# EAGLE design oshpark2.1.3-controller (EAGLE 6.6.0)
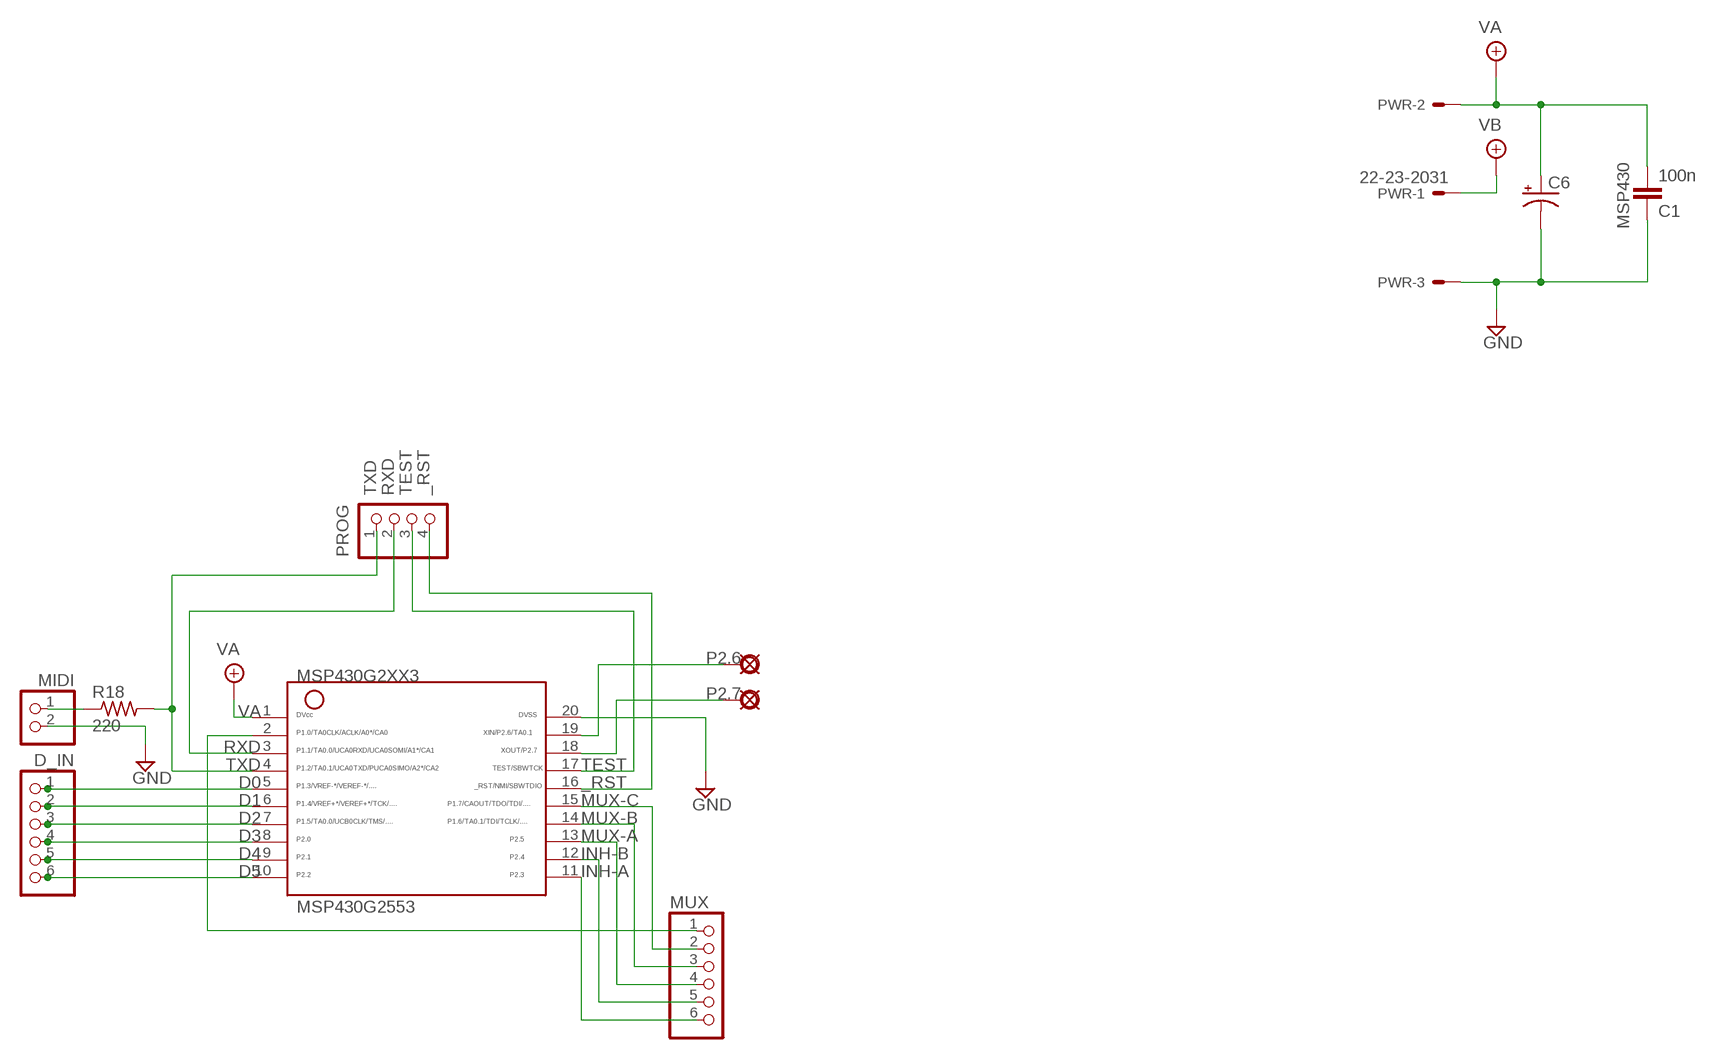
[diagram p0: schematic, sheet 1]

## Parts
C1  100n  050X030_050  [050X030_050_3]
C6  0503  [050_020_3]
D_IN  PINHD-1X6  [1X06]
MIDI  PINHD-1X2  [1X02]
MSP430G2553  G2XX3---N20  [N20]
MUX  PINHD-1X6  [1X06]
P2.6  PAD  [SQUARE]
P2.7  PAD  [SQUARE]
PROG  PINHD-1X4  [1X04]
PWR  22-23-2031  [22-23-2031]
R18  220  6MM.3  [R0207/3]

## Nets
_RST: MSP430G2553.16 PROG.4
D0: D_IN.1 MSP430G2553.5
D1: D_IN.2 MSP430G2553.6
D2: D_IN.3 MSP430G2553.7
D3: D_IN.4 MSP430G2553.8
D4: D_IN.5 MSP430G2553.9
D5: D_IN.6 MSP430G2553.10
GND: C1.1 C6.- MIDI.2 MSP430G2553.20 PWR.3
INH-A: MSP430G2553.11 MUX.6
INH-B: MSP430G2553.12 MUX.5
MUX-A: MSP430G2553.13 MUX.4
MUX-B: MSP430G2553.14 MUX.3
MUX-C: MSP430G2553.15 MUX.2
N$1: MIDI.1 R18.1
N$2: MSP430G2553.2 MUX.1
N$3: MSP430G2553.19 P2.6.1(PAD)
N$4: MSP430G2553.18 P2.7.1(PAD)
RXD: MSP430G2553.3 PROG.2
TEST: MSP430G2553.17 PROG.3
TXD: MSP430G2553.4 PROG.1 R18.2
VA: C1.2 C6.+ MSP430G2553.1 PWR.2
VB: PWR.1

## Notes on the sheet
- MSP430

## Library data of the parts
C1 = gm-caps-ceramic:050X030_050: 120 - 150pF Xicon Ceramic Disc 5mm lead spacing
C6 = gm-caps-electro-pol:050: 0.22 - 100uF Xicon values at Mouser.com: 10V: 10 - 100uF; 16V: 2.2 - 47uF; 25V: 0.47 - 47uF; 50V: 0.22 - 22uF
D_IN MUX = pinhead:PINHD-1X6: PIN HEADER
MIDI = pinhead:PINHD-1X2: PIN HEADER
MSP430G2553 = TI_MSP430_v16:G2XX3---N20: MSP430G2XX1 PDIP (N) 20 Pin Package
P2.6 P2.7 = gm-supply:PAD: PAD use this package for pads with any purpose, including input, output, send or return various pad shapes: round, square, octogonal, long, and long offset
PROG = pinhead:PINHD-1X4: PIN HEADER
PWR = con-molex:22-23-2031: .100" (2.54mm) Center Header - 3 Pin; MF: MOLEX; MPN: 22-23-2031; OC_FARNELL: 1462950; OC_NEWARK: 30C0862
R18 = gm-resistors:6MM: 6mm Resistors Leads spaced 1-6 holes apart for 0.1" perfboard. Suitable for 1/4 watt resistors.

## Board
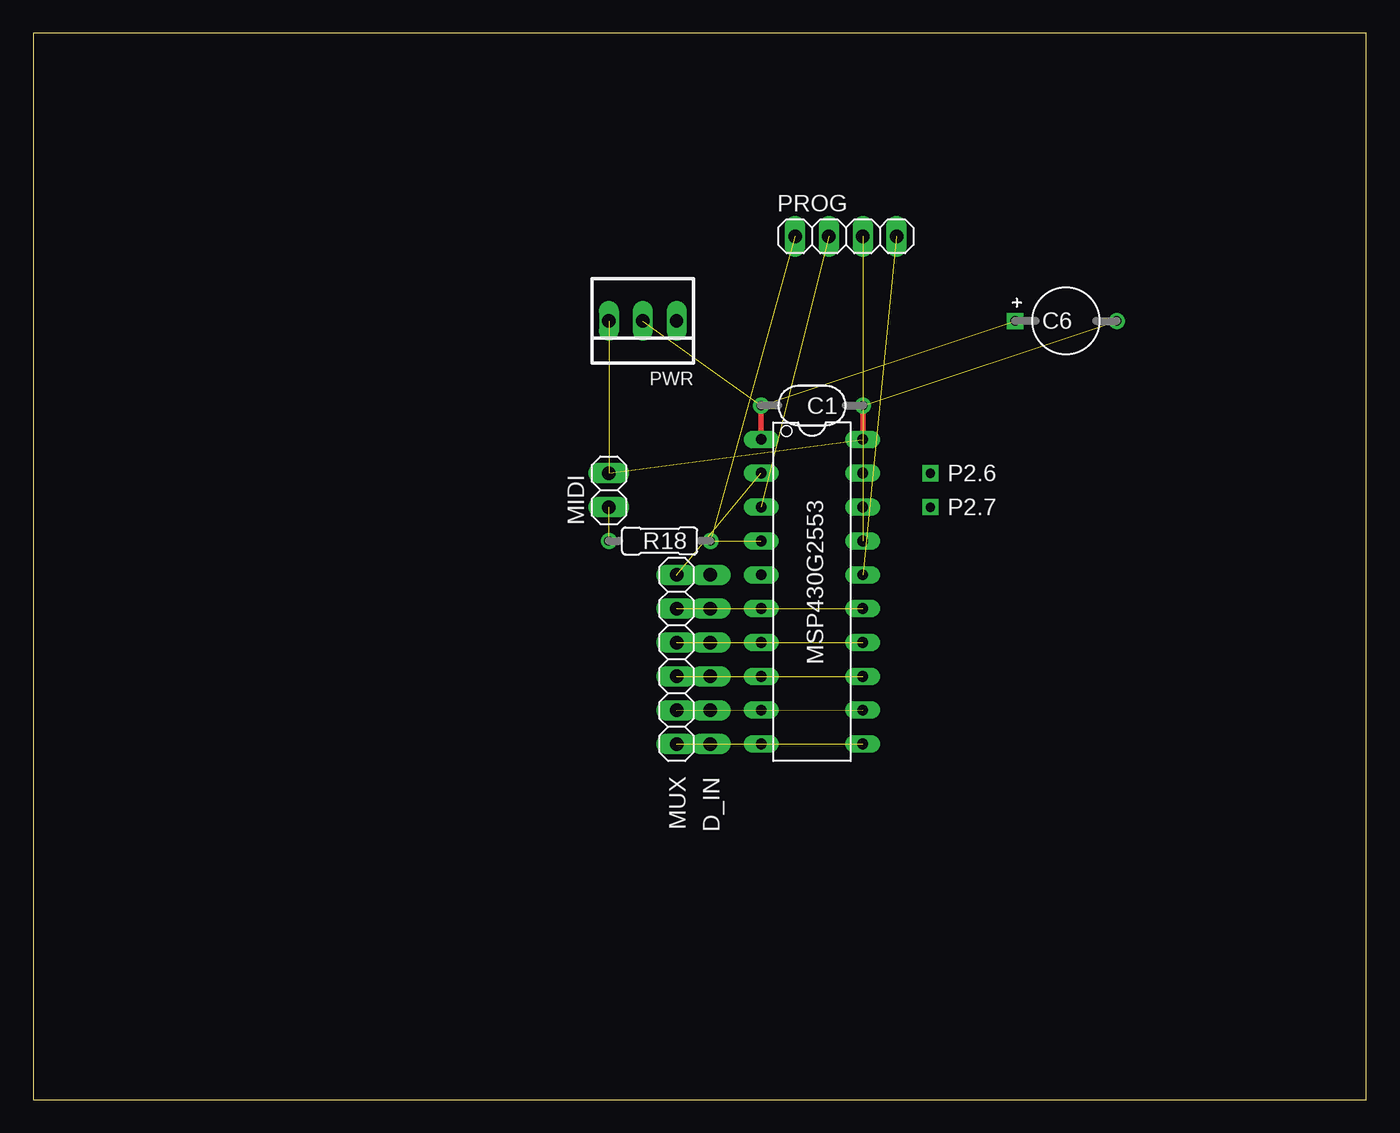
[diagram p1: board, top side]
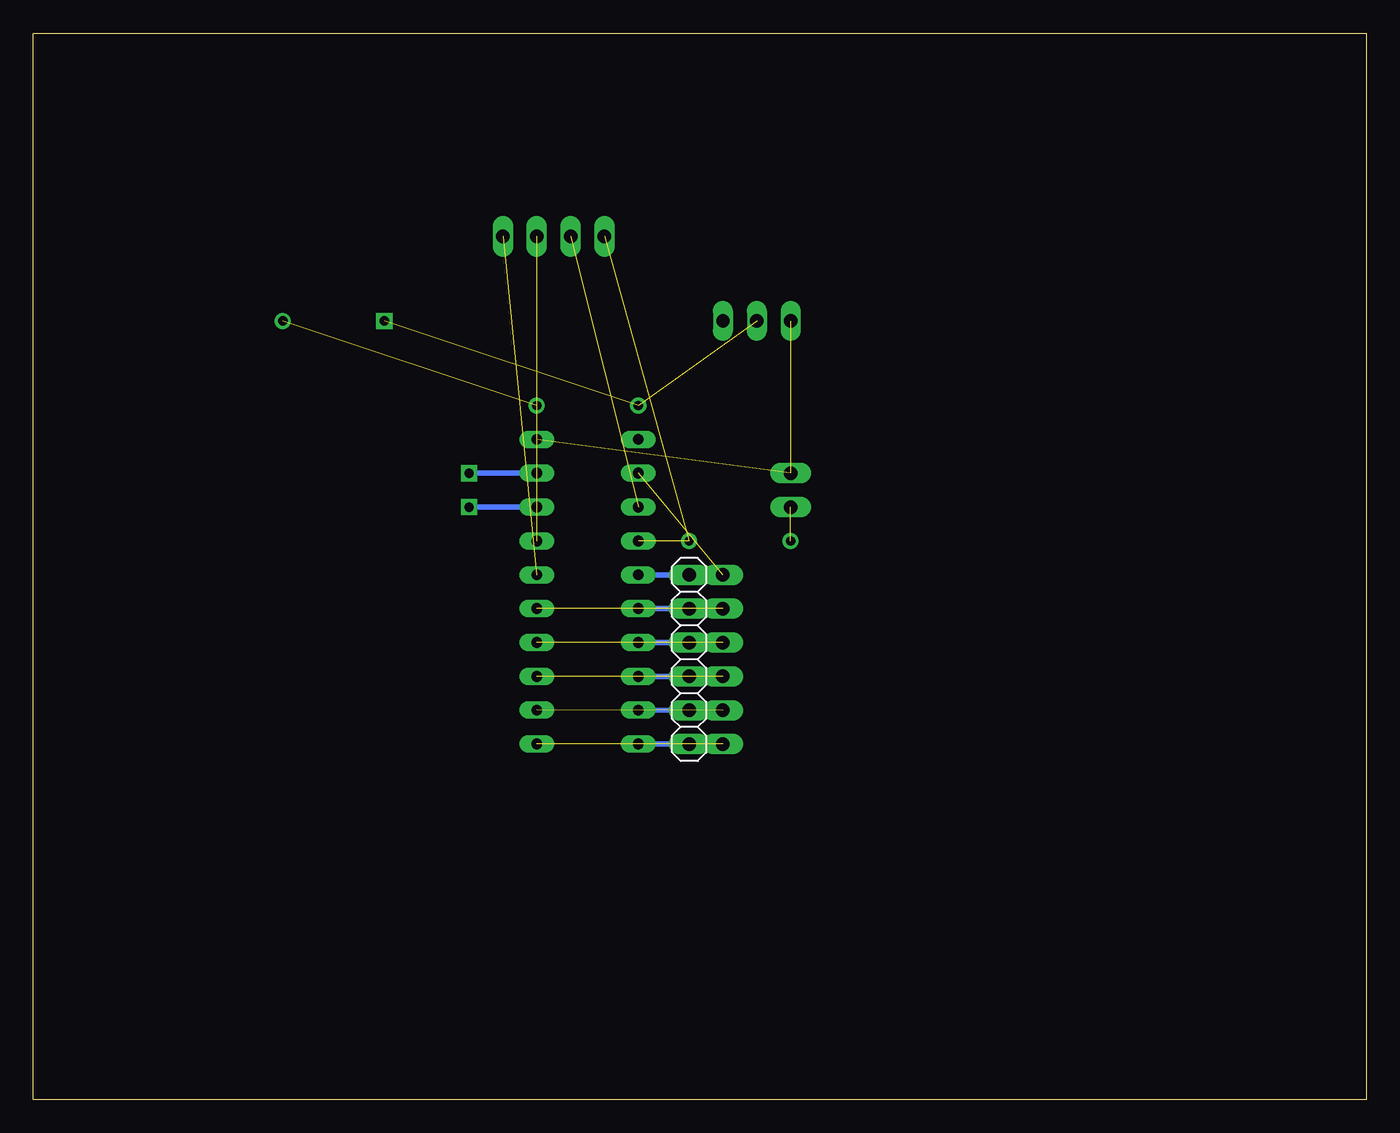
[diagram p2: board, bottom side, seen from below]

Size 100 x 80 mm. Coordinates in mm from the lower left corner, seen from the top.
Outline: 0,0 100,0 100,80 0,80 0,0
Copper layers (1*16): Top 0.035mm / dielectric 1.5mm / Bottom 0.035mm
Design rules "default": minimum track width 10mil, minimum drill 24mil, track to track 8mil, track to pad 8mil, pad to pad 8mil, via to via 8mil, smd to smd 8mil, copper to edge 40mil, drill to drill 8mil, minimum pad ring 10mil, minimum via ring 8mil, stop-mask expansion 4mil, vias tented up to drill 0mil, thermal gap 10mil

### Footprints (pad centres in the part's own frame; a part is rotated, then mirrored left to right if it is on the bottom)
050X030_050_3 = drill 0.7: 1 -3.81,0; 2 3.81,0
050_020_3 = drill 0.7 square: + -3.81,0 | drill 0.7: - 3.81,0
1X06 = drill 1.016 long: 1 -6.35,0; 2 -3.81,0; 3 -1.27,0; 4 1.27,0; 5 3.81,0; 6 6.35,0
1X02 = drill 1.016 long: 1 -1.27,0; 2 1.27,0
N20 = drill 0.813 long: 1 -11.435,-3.81; 2 -8.895,-3.81; 3 -6.355,-3.81; 4 -3.815,-3.81; 5 -1.275,-3.81; 6 1.265,-3.81; 7 3.805,-3.81; 8 6.345,-3.81; 9 8.885,-3.81; 10 11.425,-3.81; 11 11.425,3.81; 12 8.885,3.81; 13 6.345,3.81; 14 3.805,3.81; 15 1.265,3.81; 16 -1.275,3.81; 17 -3.815,3.81; 18 -6.355,3.81; 19 -8.895,3.81; 20 -11.435,3.81
SQUARE = drill 0.7 square: 1 0,0
1X04 = drill 1.016 long: 1 -3.81,0; 2 -1.27,0; 3 1.27,0; 4 3.81,0
22-23-2031 = drill 1 long: 1 -2.54,0; 2 0,0; 3 2.54,0
R0207/3 = drill 0.7: 1 -3.81,0; 2 3.81,0

### Placement (x,y rotation side)
C1  58.42,52.07 180 top
C6  77.47,58.42 0 top
D_IN  50.8,33.02 270 bottom
MIDI  43.18,45.72 90 top
MSP430G2553  58.42,38.1 270 top
MUX  48.26,33.02 270 top
P2.6  67.31,46.99 0 top
P2.7  67.31,44.45 0 top
PROG  60.96,64.77 0 top
PWR  45.72,58.42 180 top
R18  46.99,41.91 0 top

### Tracks (layer width: path | path; a pad name or v marks a point on that pad's centre or on a via)
_RST  (1 unrouted)
D0
  Bottom 0.406: D_IN.1 MSP430G2553.5
D1
  Bottom 0.406: MSP430G2553.6 D_IN.2
D2
  Bottom 0.406: D_IN.3 MSP430G2553.7
D3
  Bottom 0.406: MSP430G2553.8 D_IN.4
D4
  Bottom 0.406: D_IN.5 MSP430G2553.9
D5
  Bottom 0.406: MSP430G2553.10 D_IN.6
GND  (3 unrouted)
  Top 0.406: MSP430G2553.20 C1.1 MSP430G2553.20
INH-A  (1 unrouted)
INH-B  (1 unrouted)
MUX-A  (1 unrouted)
MUX-B  (1 unrouted)
MUX-C  (1 unrouted)
N$1  (1 unrouted)
N$2  (1 unrouted)
N$3
  Bottom 0.406: MSP430G2553.19 P2.6.1
N$4
  Bottom 0.406: P2.7.1 MSP430G2553.18
RXD  (1 unrouted)
TEST  (1 unrouted)
TXD  (2 unrouted)
VA  (2 unrouted)
  Top 0.406: MSP430G2553.1 C1.2